# EasyEDA Pro project ESP32_Wroom.eprj, schematic ESP32_Wroom_S3
Board Name: Board1; Create Date: 2025-11-14; Page Name: P1; Project Name: ESP32_Wroom; Schematic Name: ESP32_Wroom_S3; Update Date: 2026-01-07; Company: MCS_UB; Drawn: Akbar Volandra; Page Size: A3; Reviewed: Gemini_AI; Version: V1.0
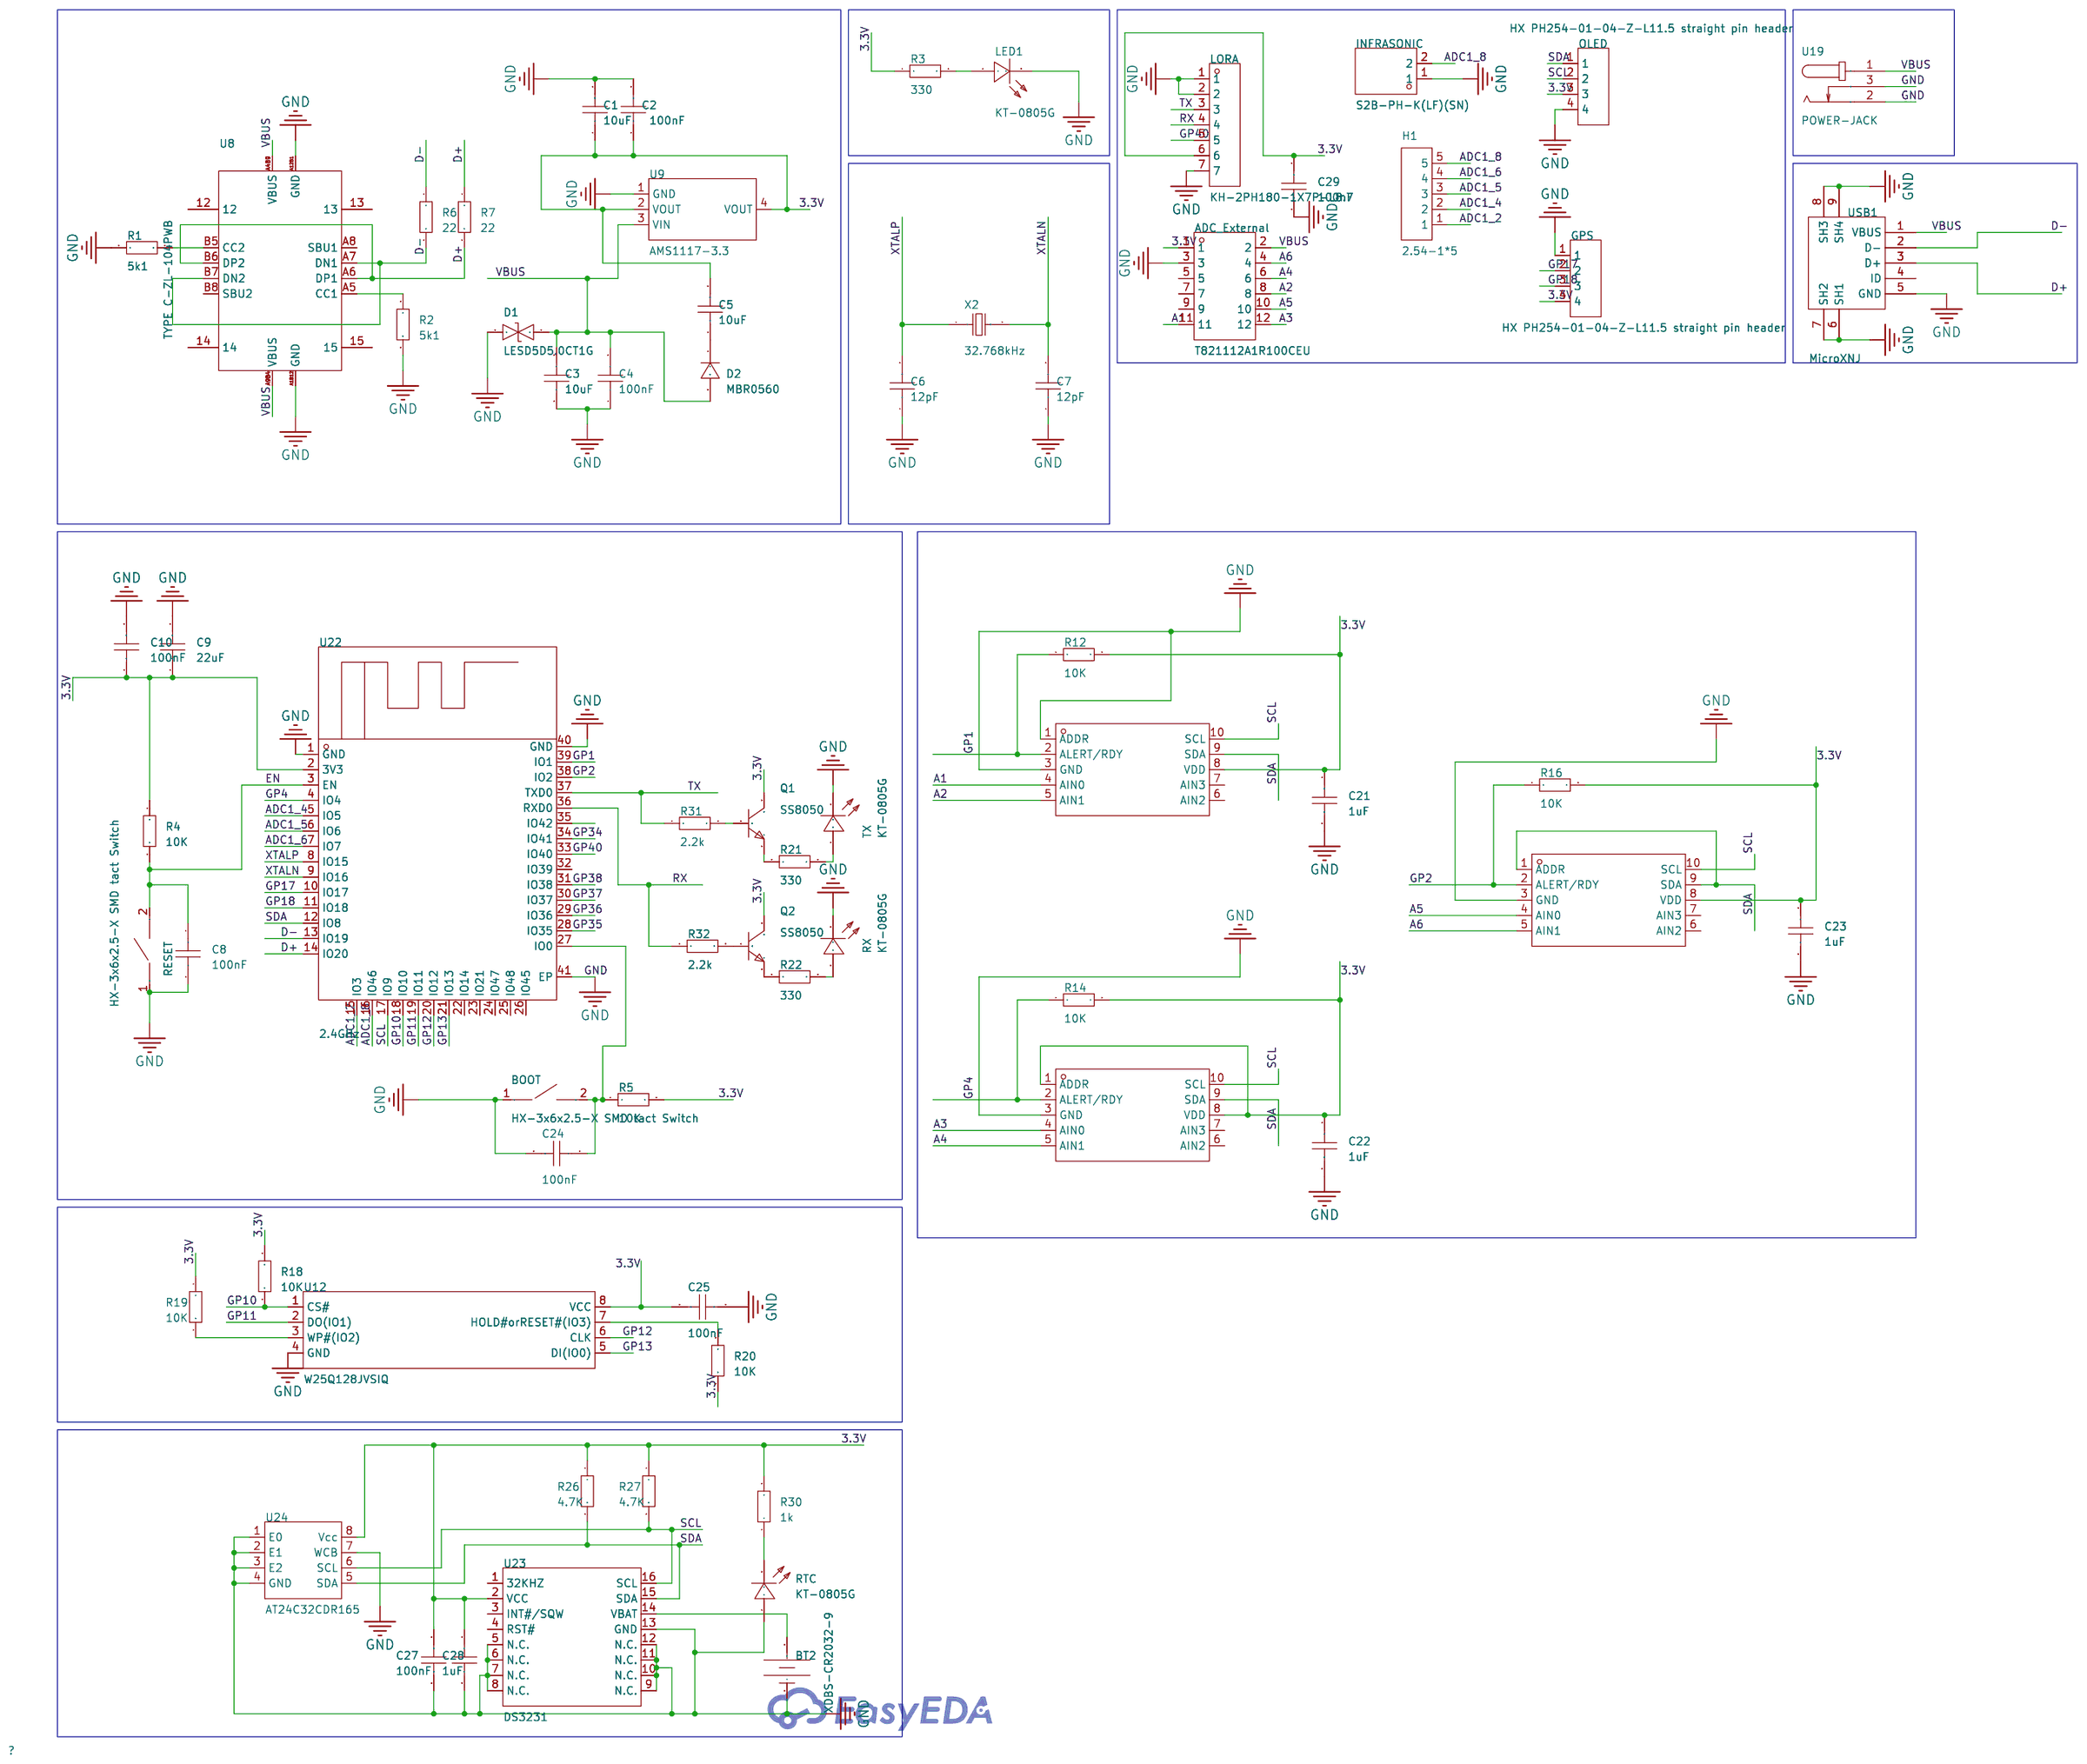
[diagram p0: schematic sheet]

## Parts
ADC_External  T821112A1R100CEU  [IDC-TH_12P-P2.54_BOOMELE-2X6P-2.54MM]
BOOT  HX-3x6x2.5-X SMD tact Switch  [SW-SMD_HX-3X6X2.5-X]
BT2  XDBS-CR2032-9  [BAT-TH_XDBS-CR2032-9]
C1  10uF  [C0603]
C2  100nF  [C0603]
C3  10uF  [C0603]
C4  100nF  [C0603]
C5  10uF  [C0603]
C6  12pF  [C0603]
C7  12pF  [C0603]
C8  100nF  [C0603]
C9  22uF  [C0603]
C10  100nF  [C0603]
C21  1uF  [C0603]
C22  1uF  [C0603]
C23  1uF  [C0603]
C24  100nF  [C0603]
C25  100nF  [C0603]
C27  100nF  [C0603]
C28  100nF  [C0603]
C29  100nF  [C0603]
D1  LESD5D5.0CT1G  [SOD-523_L1.2-W0.8-LS1.6-BI]
D2  MBR0560  [SOD-123_L2.8-W1.8-LS3.7-RD]
GPS  HX PH254-01-04-Z-L11.5 straight pin header  [HDR-TH_4P-HX-PH254-01-04-Z-L11.5]
H1  2.54-1*5  [HDR-TH_5P-P2.54-V-M]
INFRASONIC  S2B-PH-K(LF)(SN)  [CONN-TH_S2B-PH-K-LF-SN]
LED1  KT-0805G  [LED0805-R-RD]
LORA  KH-2PH180-1X7P-L8.7  [CONN-TH_KH-2PH180-1X7P-L8.7]
OLED  HX PH254-01-04-Z-L11.5 straight pin header  [HDR-TH_4P-HX-PH254-01-04-Z-L11.5]
Q1  SS8050  [SOT-23-3_L2.9-W1.3-P1.90-LS2.4-BR]
Q2  SS8050  [SOT-23-3_L2.9-W1.3-P1.90-LS2.4-BR]
R1  5k1  [R0603]
R2  5k1  [R0603]
R3  330  [R0603]
R4  10K  [R0603]
R5  10K  [R0603]
R6  22  [R0603]
R7  22  [R0603]
R12  10K  [R0603]
R14  10K  [R0603]
R16  10K  [R0603]
R18  10K  [R0603]
R19  10K  [R0603]
R20  10K  [R0603]
R21  330  [R0603]
R22  330  [R0603]
R26  4.7K  [R0603]
R27  4.7K  [R0603]
R30  1k  [R0603]
R31  2.2k  [R0603]
R32  2.2k  [R0603]
RESET  HX-3x6x2.5-X SMD tact Switch  [SW-SMD_HX-3X6X2.5-X]
RTC  KT-0805G  [LED0805-R-RD]
RX  KT-0805G  [LED0805-R-RD]
TX  KT-0805G  [LED0805-R-RD]
U8  TYPE C-ZL-104PWB  [TYPE-C-SMD_HDGC_TYPE-C-ZL-104PWB]
U9  AMS1117-3.3  [SOT-223-3_L6.5-W3.4-P2.30-LS7.0-BR]
U12  W25Q128JVSIQ  [SOIC-8_L5.3-W5.3-P1.27-LS8.0-BL]
U18  ADS1115IDGSR  [MSOP-10_L3.0-W3.0-P0.50-LS5.0-BL]
U19  POWER-JACK  [DC-IN-TH_POWER-JACK]
U20  ADS1115IDGSR  [MSOP-10_L3.0-W3.0-P0.50-LS5.0-BL]
U21  ADS1115IDGSR  [MSOP-10_L3.0-W3.0-P0.50-LS5.0-BL]
U22  2.4GHz  [WIFIM-SMD_ESP32-S3-WROOM-1-N8]
U23  DS3231  [SOIC-16_L10.3-W7.5-P1.27-LS10.3-BL]
U24  AT24C32CDR165  [SOP-8_L4.9-W3.9-P1.27-LS6.0-BL]
USB1  MicroXNJ  [MICRO-USB-SMD_MICROXNJ]
X2  32.768kHz  [FC-135R_L3.2-W1.5]

## Library data of the parts
ADC_External = T821112A1R100CEU: Supplier Part: C2928696; Supplier Footprint: Header6X2; JLCPCB Part Class: Extended Part; Supplier: LCSC
BOOT RESET = HX-3x6x2.5-X SMD tact Switch: LCSC Part Name: 6*3.5*2.5mm 立贴 轻触开关; Supplier Part: C49234125; Manufacturer: hanxia(韩下); Supplier Footprint: SMD; JLCPCB Part Class: Extended Part; Datasheet: https://atta.szlcsc.com/upload/public/pdf/source/20250618/952D7CCB54265932C14FA2108DB7C7AE.pdf; Supplier: LCSC
BT2 = XDBS-CR2032-9: LCSC Part Name: CR2032-9钮扣锂猛电池座 卧式插件BS系电池底座; Supplier Part: C48687403; Manufacturer: LX(连欣科技); Supplier Footprint: 插件; JLCPCB Part Class: Extended Part; Datasheet: https://atta.szlcsc.com/upload/public/pdf/source/20250506/6DFBD333E0DD2C074FAF42546EE1A7B7.pdf; Supplier: LCSC
C1-C10 C21-C25 C27-C29 = CAP_0603: Supplier Footprint: 0603
D1 = LESD5D5.0CT1G: 极性:双向;反向截止电压(Vrwm):5V;击穿电压(VBR):5.6V;钳位电压(Vc)@Ipp:18.6V;; LCSC Part Name: 双向ESD; Supplier Part: C383211; Manufacturer: LRC(乐山无线电); Supplier Footprint: SOD-523; JLCPCB Part Class: ExtendedPart; Datasheet: https://atta.szlcsc.com/upload/public/pdf/source/20190807/C383211_633DF4B4E2C161403226E5235FE33A1C.pdf; Supplier: LCSC; Polarity: 双向; Reverse Stand-Off Voltage (Vrwm): 5V; Breakdown Voltage (VBR): 5.6V; Peak Pulse Current(Ipp)@8/20us: 9.4A; Clamping Voltage@Ipp: 18.6V
D2 = MBR0560_1: LCSC Part Name: 电压:60V 电流:0.5A; Supplier Part: C6077529; Manufacturer: LGE(鲁光); Supplier Footprint: SOD-123FL; JLCPCB Part Class: Extended Part; Datasheet: https://item.szlcsc.com/datasheet/MBR0560/7017746.html; Supplier: LCSC; Diode Configuration: Independent; Voltage - DC Reverse(Vr): 60V; Current - Rectified: 500mA; Operating Junction Temperature Range: -55℃~+175℃; Non-Repetitive Peak Forward Surge Current: 15A
GPS OLED = HX PH254-01-04-Z-L11.5 straight pin header: LCSC Part Name: 1x4P 间距:2.54mm 方针 直插; Supplier Part: C52016392; Manufacturer: hanxia(韩下); Supplier Footprint: 插件,P=2.54mm; JLCPCB Part Class: Extended Part; Datasheet: https://item.szlcsc.com/datasheet/HX%2520PH254-01-04-Z-L11.5%2520straight%2520pin%2520header/54760437.html; Supplier: LCSC; Pin Structure: 1x4P; Pitch: 2.54mm; Circluar Pins/Square Pins: Pin Header; Mounting Type: Through Hole; Number of Rows: 1; Number of Pins: 4P; Current Rating: 3A; Voltage Rating (Max): 1kV; Length of Mating Pin: 6mm; Insulation Height: 2.5mm; Length of End Connection Pin: 3mm; Contact Material: Brass; Contact Plating: Gold; Operating Temperature: -40℃~+105℃
H1 = 2.54-1*5: LCSC Part Name: 1x5P 间距:2.54mm 方针 直插; Supplier Part: C5156614; Manufacturer: ZHOURI(洲日); Supplier Footprint: 插件,P=2.54mm; JLCPCB Part Class: Extended Part; Datasheet: https://item.szlcsc.com/datasheet/2.54-1*5/5790714.html; Supplier: LCSC; Pin Structure: 1x5P; Pitch: 2.54mm; Circluar Pins/Square Pins: Pin Header; Mounting Type: Through Hole; Number of Rows: 1; Number of Pins: 5P; Current Rating: 2.5A; Length of Mating Pin: 6mm; Insulation Height: 2.54mm; Length of End Connection Pin: 3mm; Contact Material: Brass; Contact Plating: Gold; Operating Temperature: -40℃~+105℃
INFRASONIC = S2B-PH-K(LF)(SN): LCSC Part Name: 1x2P 间距:2mm 弯插 系列:PH; Supplier Part: C265016; Manufacturer: JST; Supplier Footprint: 弯插,P=2mm; JLCPCB Part Class: Extended Part; Datasheet: https://item.szlcsc.com/datasheet/S2B-PH-K(LF)(SN)/255437.html; Supplier: LCSC; Pins Structure: 1x2P; Pitch: 2mm; Mounting Type: Right Angle; Reference Series: PH; Number of Pins: 2P; Number of Rows: 1; Number of PINs Per Row: 2; Current Rating: 2A; Contact Material: Brass; Contact Plating: Tin; Operating Temperature: -25℃~+85℃; Voltage Rating: 100V; Plastic Material: PA66; Flame Retardant Rating: UL94V-0; Supplementary Features: K Pin; Color: White; Z-Height of the Board: 4.8mm; X-Length of Bottom Edge on Board (Spacing Line): 5.9mm; Y-Width of Bottom Edge on Board: 7.6mm
LED1 RTC RX TX = KT-0805G: LCSC Part Name: 0805 翠绿 高亮; Supplier Part: C2297; Manufacturer: KENTO; Supplier Footprint: 0805; JLCPCB Part Class: Basic Part; Datasheet: https://item.szlcsc.com/datasheet/KT-0805G/2670.html; Supplier: LCSC; Illumination Color: Emerald Green; Voltage - Forward(Vf): 2.6V~3.1V; Power(Watts): 100mW; Forward Current: 5mA; Wavelength - Dominant: 513nm~528nm; Peak Wavelength: 525nm; Luminous Intensity: 430mcd; Viewing Angle: 120°; Operating Temperature: -40℃~+85℃
LORA = KH-2PH180-1X7P-L8.7: LCSC Part Name: 1x7P 间距:2mm 方针 直插; Supplier Part: C20610444; Manufacturer: kinghelm(金航标); Supplier Footprint: 插件,P=2mm; JLCPCB Part Class: Extended Part; Datasheet: https://item.szlcsc.com/datasheet/KH-2PH180-1X7P-L8.7/21961089.html; Supplier: LCSC; Pin Structure: 1x7P; Pitch: 2mm; Circluar Pins/Square Pins: Pin Header; Mounting Type: Through Hole; Number of Rows: 1; Number of Pins: 7P; Current Rating: 1.5A; Length of Mating Pin: 3.9mm; Insulation Height: 2mm; Length of End Connection Pin: 2.8mm; Contact Material: Brass; Contact Plating: Gold; Operating Temperature: -40℃~+105℃; Color: Black
Q1 Q2 = SS8050_C916392: LCSC Part Name: NPN 电流:1.5A 电压:25V; Supplier Part: C916392; Manufacturer: JSMSEMI(杰盛微); Supplier Footprint: SOT-23; JLCPCB Part Class: Extended Part; Datasheet: https://item.szlcsc.com/datasheet/SS8050/990888.html; Supplier: LCSC; type: NPN; Current - Collector(Ic): 1.5A; Collector - Emitter Voltage VCEO: 25V; Pd - Power Dissipation: 300mW; Current - Collector Cutoff: 100nA; Vce Saturation(VCE(sat)): 500mV; Operating Temperature: -55℃~+150℃
R1 R2 R6 R7 = Res_0603: Supplier Footprint: 0603
R3-R5 R12 R14 R16 R18-R22 R26 R27 R30-R32 = 0603WAF1503T5E: LCSC Part Name: 150kΩ ±1% 100mW 厚膜电阻; Supplier Part: C22807; Manufacturer: UNI-ROYAL(厚声); Supplier Footprint: 0603; JLCPCB Part Class: Basic Part; Datasheet: https://item.szlcsc.com/datasheet/0603WAF1503T5E/23534.html; Supplier: LCSC; Type: Thick Film Resistors; Tolerance: ±1%; Power(Watts): 0.1W; Voltage-Supply(Max): 75V; Temperature Coefficient: ±100ppm/℃; Operating Temperature: -55℃~+155℃
U8 = TYPE C-ZL-104PWB: LCSC Part Name: Type-C; Supplier Part: C5273952; Manufacturer: HDGC(华德共创); Supplier Footprint: SMD; JLCPCB Part Class: Extended Part; Datasheet: https://item.szlcsc.com/datasheet/TYPE%2520C-ZL-104PWB/6003803.html; Supplier: LCSC; Connector Type: Type-C; Number of Contacts: 16P
U9 = AMS1117-3.3_C6186: LCSC Part Name: 输出3.3V 1A; Supplier Part: C6186; Manufacturer: AMS; Supplier Footprint: SOT-223; JLCPCB Part Class: Basic Part; Datasheet: https://item.szlcsc.com/datasheet/AMS1117-3.3/6652.html; Supplier: LCSC; Output Type: Fixed; Voltage - Supply: 16V; Output Voltage: 3.3V; Output Current: 1A; Power Supply Rejection Ratio (PSRR): 72dB@(120Hz); Voltage Dropout: 1.1V@(800mA); standby current: 5mA; Noise: 0.003%Vout; Features: Over Current Protection；Over Temperature Protection; Operating Temperature: -40℃~+125℃; Output Configuration: Positive; Number of Outputs: 1
U12 = W25Q128JVSIQ_C113767: Interface:SPI Memory Size:- Clock Frequency:133MHz Voltage - Supply:2.7V~3.6V Voltage - Supply:2.7V~3.6V Program / Erase Cycles:100,000 Cycles Page Programming Time (Tpp):3ms Operating Temperature:- Operating Temperature:-; Supplier Part: C113767; Manufacturer: Winbond(华邦); Supplier Footprint: SOIC-8-208mil; JLCPCB Part Class: Extended Part; Datasheet: https://atta.szlcsc.com/upload/public/pdf/source/20180329/C113767_097B64D788F6E3FFB2E9CB46CB6C1427.pdf; Supplier: LCSC; Interface: SPI; Clock Frequency: 133MHz; Voltage - Supply: 2.7V~3.6V; Program / Erase Cycles: 100,000 Cycles; Page Programming Time (Tpp): 3ms
U18 U20 U21 = ADS1115IDGSR: Resolution(Bits):16Bit Sampling Rate:- number of channels:4 Voltage - Supply:2V~5.5V Voltage - Supply:2V~5.5V Interface:I2C differential input:- Integral non - linearity:1LSB Integral non - linearity:1LSB Operating Temperature:-40℃~+125℃ Operating Tempera; LCSC Part Name: 具有内部基准、振荡器和可编程比较器且兼容 I2C 的ADS111x、超小型、低功耗 860SPS、16位ADC; Supplier Part: C37593; Manufacturer: TI(德州仪器); Supplier Footprint: VSSOP-10; JLCPCB Part Class: Extended Part; Datasheet: https://www.ti.com/cn/lit/gpn/ads1115; Supplier: LCSC; Resolution(Bits): 16Bit; number of channels: 4; Voltage - Supply: 2V~5.5V; Interface: I2C; Integral non - linearity: 1LSB; Operating Temperature: -40℃~+125℃
U19 = POWER-JACK: Supplier Part: C9900001795; JLCPCB Part Class: Extended Part; Supplier: LCSC
U22 = ESP32-S3-WROOM-1-N8: LCSC Part Name: 通用型Wi-Fi+低功耗蓝牙MCU模组; Supplier Part: C2913198; Manufacturer: ESPRESSIF(乐鑫); Supplier Footprint: SMD,18x25.5mm; JLCPCB Part Class: Extended Part; Datasheet: https://atta.szlcsc.com/upload/public/pdf/source/20221026/9A44C6421221D672346AAE72DF9F8146.pdf; Supplier: LCSC; Core Processor: ESP32-S3 Chip; Support Interface: I2C；GPIO；SPI；PWM；ADC；UART；USB；I2S
U23 = DS3231M+: LCSC Part Name: 高精度RTC集成MEMS谐振器; Supplier Part: C1520508; Manufacturer: ADI(亚德诺)/MAXIM(美信); Supplier Footprint: SOIC-16-300mil; JLCPCB Part Class: Extended Part; Datasheet: https://atta.szlcsc.com/upload/public/pdf/source/20170620/1497944726830.pdf; Supplier: LCSC; Interface: I2C; Operating Voltage: 2.3V~5.5V; Operating Temperature: -40℃~+85℃
U24 = AT24C32CDR165: LCSC Part Name: EEPROM; Supplier Part: C51026297; Manufacturer: GMIC(绿微); Supplier Footprint: SOP-8; JLCPCB Part Class: Extended Part; Datasheet: https://item.szlcsc.com/datasheet/AT24C32CDR165/53672975.html; Supplier: LCSC; Interface: I2C; Memory Size: 32Kbit; Clock Frequency: 1MHz; Voltage - Supply: 1.8V~5.5V; Write Cycle Time(Tw): 5ms; Data Retention - TDR (Year): 100 Years; Write Cycle Endurance: 1,000,000 Cycles; Operating Temperature: -40℃~+85℃
USB1 = MicroXNJ: LCSC Part Name: Micro-B 母 卧贴; Supplier Part: C404969; Manufacturer: SHOU HAN(首韩); Supplier Footprint: SMD; JLCPCB Part Class: Extended Part; Datasheet: https://item.szlcsc.com/datasheet/MicroXNJ/392534.html; Supplier: LCSC; Connector Type: Micro-B; Protocol Standard: USB 2.0; Gender: Female; Mounting Type: Surface Mount, Right Angle; Number of Contacts: 5P; Number of Ports: 1; Current Rating-Power: 1.8A; Voltage Rating: 30V; Connect-Disconnect Life: 5,000 Cycles; Detection color: Black; Operating Temperature: -20℃~+85℃
X2 = Q13FC13500004_C32346: LCSC Part Name: 32.768kHz ±20ppm 12.5pF; Supplier Part: C32346; Manufacturer: EPSON(爱普生); Manufacturer Part: Q13FC13500004; Supplier Footprint: SMD3215-2P; JLCPCB Part Class: Basic Part; Datasheet: https://atta.szlcsc.com/upload/public/pdf/source/20240418/0E0FF5F0356BA3753F616001439D1416.pdf; Supplier: LCSC; Crystal Type: Surface Mount Crystal; Normal temperature Frequency Tolerance: ±20ppm; Equivalent Series Resistance (ESR): 70kΩ

## Nets
3.3V: ADC_External.1 C1.1 C2.1 C5.2 C9.1 C10.1 C21.1 C22.1 C23.1 C25.2 C27.1 C28.1 C29.1 GPS.4 LORA.6 OLED.3 Q1.3(C) Q2.3(C) R3.1 R4.1 R5.2 R12.2 R14.2 R16.2 R18.1 R19.1 R20.2 R26.1 R27.1 R30.2 U9.2(VOUT) U9.4(VOUT) U12.8(VCC) U18.8(VDD) U20.1(ADDR) U20.8(VDD) U21.8(VDD) U22.2(3V3) U23.2(VCC) U24.8(Vcc)
GND: ADC_External.3 BOOT.1 BT2.2(-) C1.2 C2.2 C3.1 C4.1 C6.1 C7.1 C8.2 C9.2 C10.2 C21.2 C22.2 C23.2 C24.2 C25.1 C27.2 C28.2 C29.2 D1.2 GPS.1 INFRASONIC.1 LED1.2(K) LORA.1 LORA.2 LORA.7 OLED.4 R1.1 R2.2 RESET.1 RTC.1(A) RX.2(K) TX.2(K) U8.A1B12(GND) U8.A12B1(GND) U9.1(GND) U12.4(GND) U18.1(ADDR) U18.3(GND) U19.2 U19.3 U20.3(GND) U21.3(GND) U22.1(GND) U22.40(GND) U22.41(EP) U23.5(N.C.) U23.6(N.C.) U23.7(N.C.) U23.8(N.C.) U23.9(N.C.) U23.10(N.C.) U23.11(N.C.) U23.12(N.C.) U23.13(GND) U24.1(E0) U24.2(E1) U24.3(E2) U24.4(GND) U24.7(WCB) USB1.5(GND) USB1.6(SH1) USB1.7(SH2) USB1.8(SH3) USB1.9(SH4)
VBUS: ADC_External.2 C3.2 C4.2 D1.1 D2.2 U8.A4B9(VBUS) U8.A9B4(VBUS) U9.3(VIN) U19.1 USB1.1(VBUS)
A1: ADC_External.11 U18.4(AIN0)
A2: ADC_External.8 U18.5(AIN1)
A3: ADC_External.12 U20.4(AIN0)
A4: ADC_External.6 U20.5(AIN1)
A5: ADC_External.10 U21.4(AIN0)
A6: ADC_External.4 U21.5(AIN1)
ADC1_2: H1.1 U22.15(IO3)
ADC1_4: H1.2 U22.5(IO5)
ADC1_5: H1.3 U22.6(IO6)
ADC1_6: H1.4 U22.7(IO7)
ADC1_8: H1.5 INFRASONIC.2 U22.16(IO46)
D+: R7.1 R7.2 U8.A6(DP1) U8.B6(DP2) U22.14(IO20) USB1.3(D+)
D-: R6.1 R6.2 U8.A7(DN1) U8.B7(DN2) U22.13(IO19) USB1.2(D-)
EN: C8.1 R4.2 RESET.2 U22.3(EN)
GP1: R12.1 U18.2(ALERT/RDY) U22.39(IO1)
GP2: R16.1 U21.2(ALERT/RDY) U22.38(IO2)
GP4: R14.1 U20.2(ALERT/RDY) U22.4(IO4)
GP10: R18.2 U12.1(CS#) U22.18(IO10)
GP11: U12.2(DO(IO1)) U22.19(IO11)
GP12: U12.6(CLK) U22.20(IO12)
GP13: U12.5(DI(IO0)) U22.21(IO13)
GP17: GPS.2 U22.10(IO17)
GP18: GPS.3 U22.11(IO18)
GP34: U22.34(IO41)
GP35: U22.28(IO35)
GP36: U22.29(IO36)
GP37: U22.30(IO37)
GP38: U22.31(IO38)
GP40: LORA.5 U22.33(IO40)
RX: LORA.4 R32.1 U22.36(RXD0)
SCL: OLED.2 R27.2 U18.10(SCL) U20.10(SCL) U21.10(SCL) U22.17(IO9) U23.16(SCL) U24.6(SCL)
SDA: OLED.1 R26.2 U18.9(SDA) U20.9(SDA) U21.1(ADDR) U21.9(SDA) U22.12(IO8) U23.15(SDA) U24.5(SDA)
TX: LORA.3 R31.1 U22.37(TXD0)
XTALN: C7.2 U22.9(IO16) X2.2
XTALP: C6.2 U22.8(IO15) X2.1
$1N3274: R1.2 U8.B5(CC2)
$1N3576: R2.1 U8.A5(CC1)
$1N3936: C5.1 D2.1
$1N4181: LED1.1(A) R3.2
$1N5037: BOOT.2 C24.1 R5.1 U22.27(IO0)
$1N8957: R19.2 U12.3(WP#(IO2))
$1N9100: R20.1 U12.7(HOLD#orRESET#(IO3))
$1N14321: Q1.1(B) R31.2
$1N14407: Q1.2(E) R21.1
$1N14412: R21.2 TX.1(A)
$1N14569: Q2.1(B) R32.2
$1N14578: R22.2 RX.1(A)
$1N28262: R30.1 RTC.2(K)
$1N34936: Q2.2(E) R22.1
$1N34953: BT2.1(+) U23.14(VBAT)

Not connected (* = marked no-connect by the designer): ADC_External 5 7 9; U8 12 13 14 15 A8(SBU1) B8(SBU2); U18 6(AIN2) 7(AIN3); U20 6(AIN2) 7(AIN3); U21 6(AIN2) 7(AIN3); U22 22(IO14) 23(IO21) 24(IO47) 25(IO48) 26(IO45) 32(IO39) 35(IO42); U23 1(32KHZ) 3(INT#/SQW) 4(RST#); USB1 4(ID)
